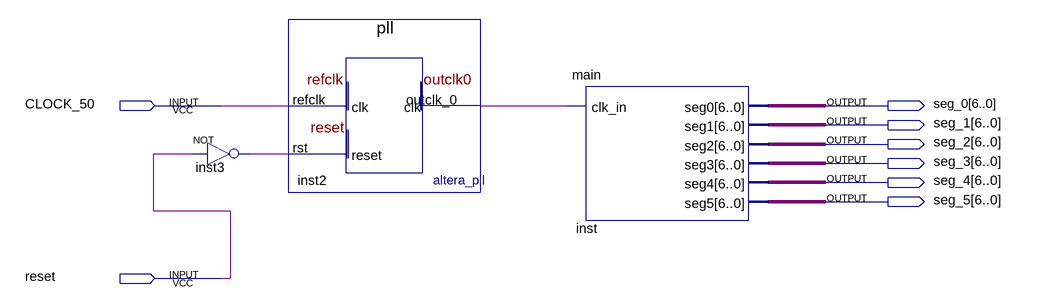
[diagram p0: schematic sheet]
// Quartus schematic Square_adder_test.bdf as structural Verilog: 3 symbols, 8 pins
module Square_adder_test (
  input  CLOCK_50,
  input  reset,
  output [6:0] seg_0,
  output [6:0] seg_1,
  output [6:0] seg_2,
  output [6:0] seg_3,
  output [6:0] seg_4,
  output [6:0] seg_5
);

  wire inst2_outclk_0, inst3_out;

  not inst3 (inst3_out, reset);
  pll inst2 (.refclk(CLOCK_50), .rst(inst3_out), .outclk_0(inst2_outclk_0));
  main inst (
    .clk_in(inst2_outclk_0), .seg0(seg_0), .seg1(seg_1), .seg2(seg_2), .seg3(seg_3), .seg4(seg_4),
    .seg5(seg_5));
endmodule
